# Altium schematic sheet schematic.SchDoc
size 368 x 266 mm
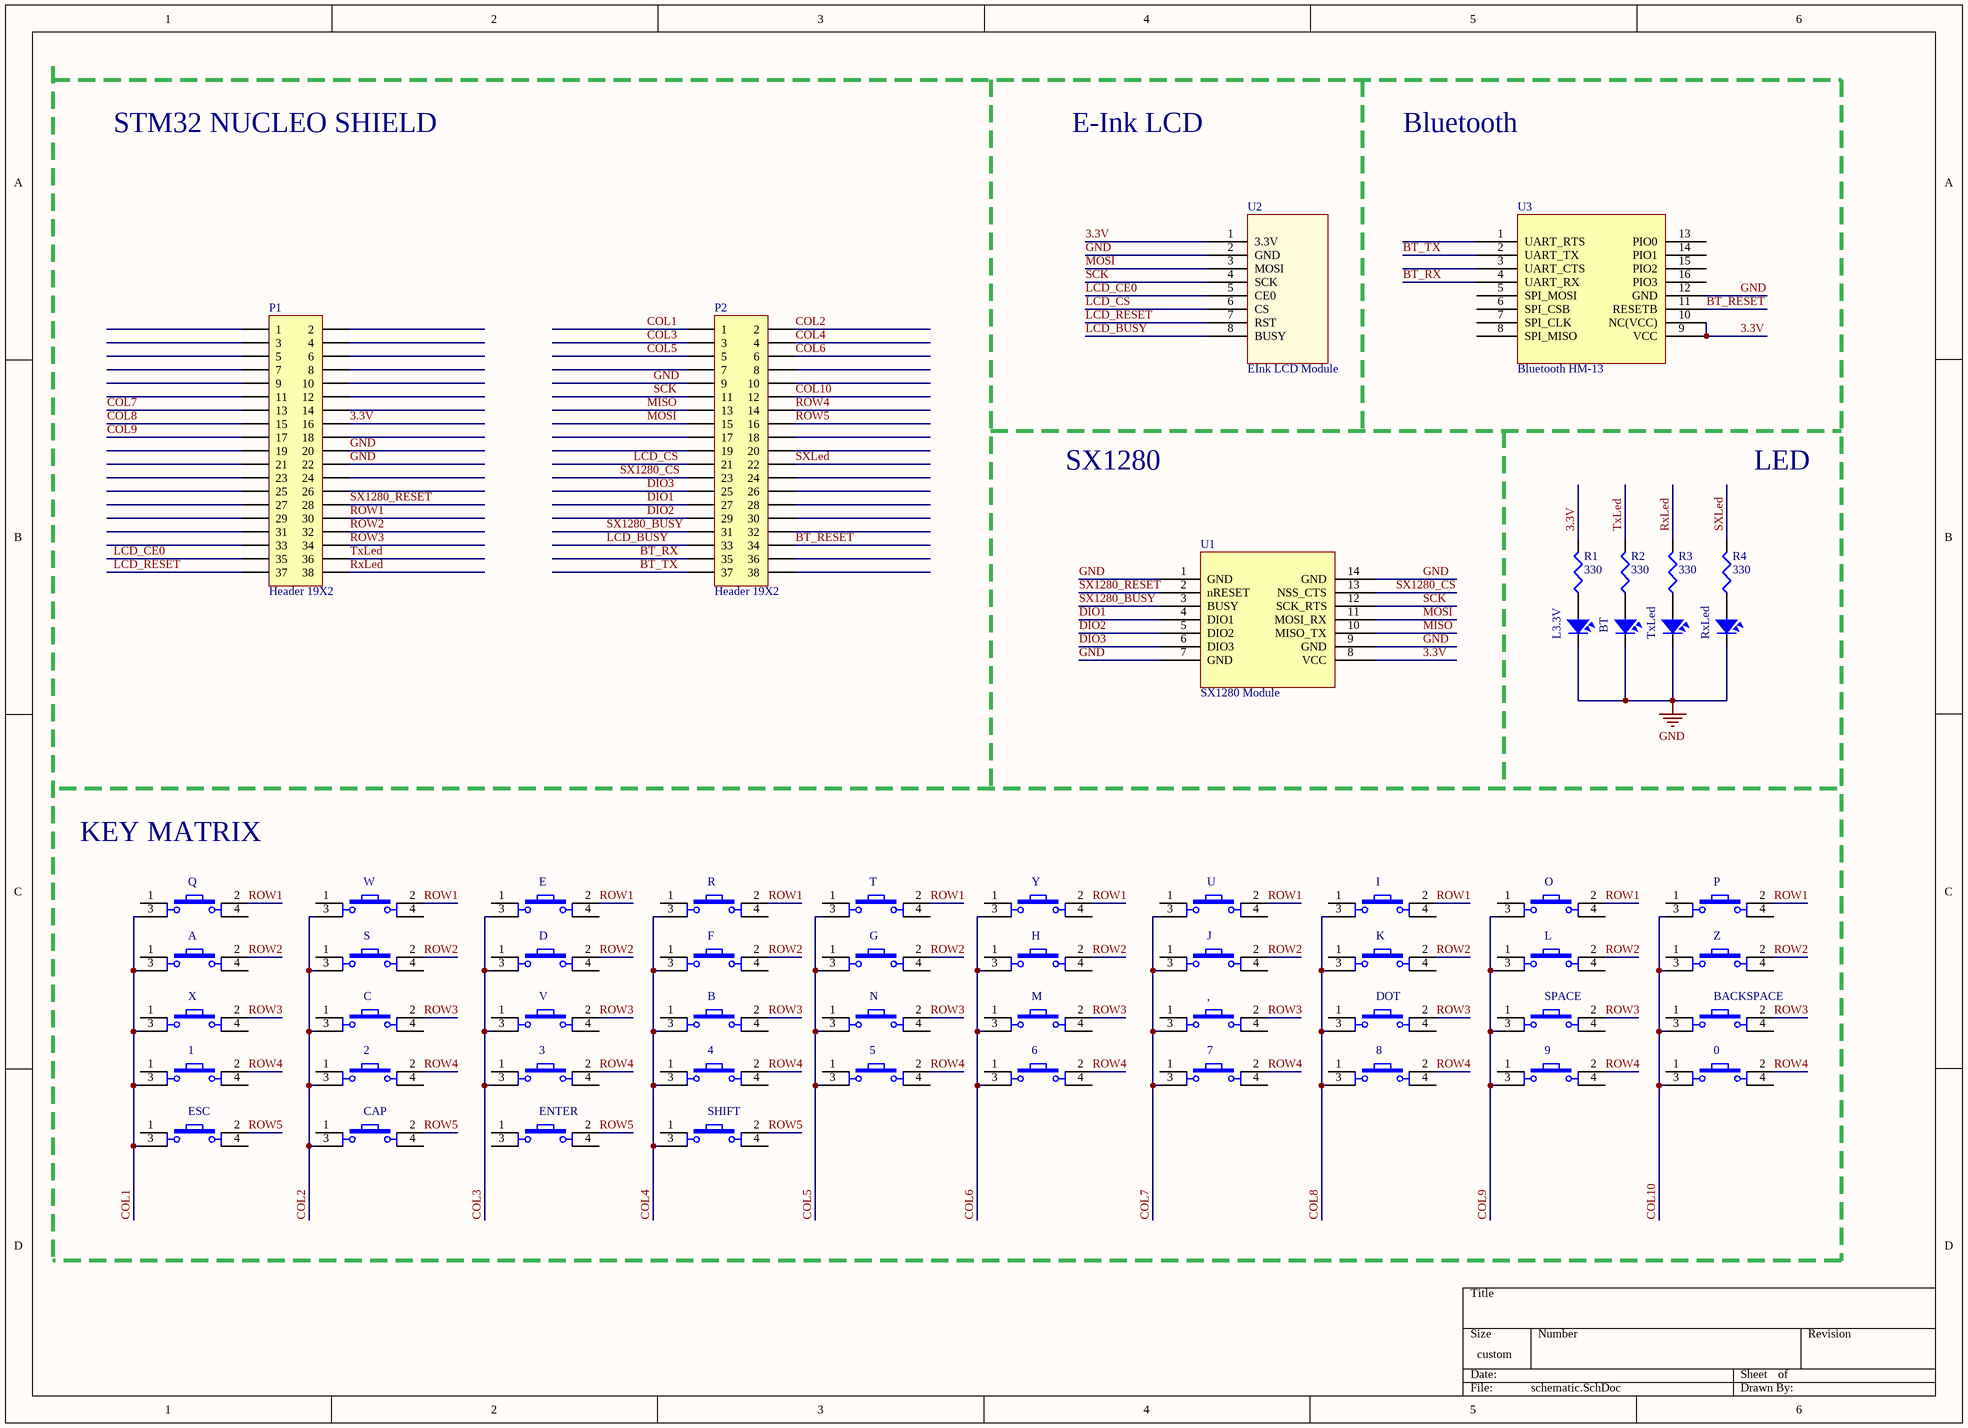
[diagram p0: schematic.SchDoc]

## Parts
0  SW  [Button 4 pins]  (value not drawn)
1  SW  [Button 4 pins]  (value not drawn)
2  SW  [Button 4 pins]  (value not drawn)
3  SW  [Button 4 pins]  (value not drawn)
4  SW  [Button 4 pins]  (value not drawn)
5  SW  [Button 4 pins]  (value not drawn)
6  SW  [Button 4 pins]  (value not drawn)
7  SW  [Button 4 pins]  (value not drawn)
8  SW  [Button 4 pins]  (value not drawn)
9  SW  [Button 4 pins]  (value not drawn)
,  SW  [Button 4 pins]  (value not drawn)
A  SW  [Button 4 pins]  (value not drawn)
B  SW  [Button 4 pins]  (value not drawn)
BACKSPACE  SW  [Button 4 pins]  (value not drawn)
BT  LED SMD  [SM-LED-0805-Blue]  (value not drawn)
C  SW  [Button 4 pins]  (value not drawn)
CAP  SW  [Button 4 pins]  (value not drawn)
D  SW  [Button 4 pins]  (value not drawn)
DOT  SW  [Button 4 pins]  (value not drawn)
E  SW  [Button 4 pins]  (value not drawn)
ENTER  SW  [Button 4 pins]  (value not drawn)
ESC  SW  [Button 4 pins]  (value not drawn)
F  SW  [Button 4 pins]  (value not drawn)
G  SW  [Button 4 pins]  (value not drawn)
H  SW  [Button 4 pins]  (value not drawn)
I  SW  [Button 4 pins]  (value not drawn)
J  SW  [Button 4 pins]  (value not drawn)
K  SW  [Button 4 pins]  (value not drawn)
L  SW  [Button 4 pins]  (value not drawn)
L3.3V  LED SMD  [SM-LED-0805-Blue]  (value not drawn)
M  SW  [Button 4 pins]  (value not drawn)
N  SW  [Button 4 pins]  (value not drawn)
O  SW  [Button 4 pins]  (value not drawn)
P  SW  [Button 4 pins]  (value not drawn)
P1  Header 19X2  [HDR2X19]
P2  Header 19X2  [HDR2X19]
Q  SW  [Button 4 pins]  (value not drawn)
R  SW  [Button 4 pins]  (value not drawn)
R1  value 330  [J1-0603]  (hidden comment: Res3)
R2  value 330  [J1-0603]  (hidden comment: Res3)
R3  value 330  [J1-0603]  (hidden comment: Res3)
R4  value 330  [J1-0603]  (hidden comment: Res3)
RxLed  LED SMD  [SM-LED-0805-Blue]  (value not drawn)
S  SW  [Button 4 pins]  (value not drawn)
SHIFT  SW  [Button 4 pins]  (value not drawn)
SPACE  SW  [Button 4 pins]  (value not drawn)
T  SW  [Button 4 pins]  (value not drawn)
TxLed  LED SMD  [SM-LED-0805-Blue]  (value not drawn)
U  SW  [Button 4 pins]  (value not drawn)
U1  SX1280 Module  [SX1280 Module]
U2  EInk LCD Module  [EInk_Module]
U3  Bluetooth HM-13  [Bluetooth HM-13]
V  SW  [Button 4 pins]  (value not drawn)
W  SW  [Button 4 pins]  (value not drawn)
X  SW  [Button 4 pins]  (value not drawn)
Y  SW  [Button 4 pins]  (value not drawn)
Z  SW  [Button 4 pins]  (value not drawn)

## Nets
GND: BT.2 L3.3V.2 P1.20 P1.22 P2.9 RxLed.2 TxLed.2 U1.1(GND) U1.7(GND) U1.9(GND) U1.14(GND) U2.2(GND) U3.12(GND)
3.3V: P1.16 R1.2 U1.8(VCC) U2.1(3.3V) U3.9(VCC) U3.10(NC(VCC))
BT_RESET: P2.34 U3.11(RESETB)
BT_RX: P2.35 U3.4(UART_RX)
BT_TX: P2.37 U3.2(UART_TX)
COL1: 1.3 A.3 ESC.3 P2.1 Q.3 X.3
COL2: 2.3 C.3 CAP.3 P2.2 S.3 W.3
COL3: 3.3 D.3 E.3 P2.3 V.3
COL4: 4.3 B.3 F.3 P2.4 R.3 SHIFT.3
COL5: 5.3 G.3 N.3 P2.5 T.3
COL6: 6.3 H.3 M.3 P2.6 Y.3
COL7: 7.3 ,.3 J.3 P1.13 U.3
COL8: 8.3 DOT.3 I.3 K.3 P1.15
COL9: 9.3 L.3 O.3 P1.17 SPACE.3
COL10: 0.3 BACKSPACE.3 P.3 P2.12 Z.3
DIO1: P2.27 U1.4(DIO1)
DIO2: P2.29 U1.5(DIO2)
DIO3: P2.25 U1.6(DIO3)
LCD_BUSY: P2.33 U2.8(BUSY)
LCD_CE0: P1.35 U2.5(CE0)
LCD_CS: P2.21 U2.6(CS)
LCD_RESET: P1.37 U2.7(RST)
MISO: P2.13 U1.10(MISO_TX)
MOSI: P2.15 U1.11(MOSI_RX) U2.3(MOSI)
ROW1: E.2 I.2 O.2 P.2 P1.30 Q.2 R.2 T.2 U.2 W.2 Y.2
ROW2: A.2 D.2 F.2 G.2 H.2 J.2 K.2 L.2 P1.32 S.2 Z.2
ROW3: ,.2 B.2 BACKSPACE.2 C.2 DOT.2 M.2 N.2 P1.34 SPACE.2 V.2 X.2
ROW4: 0.2 1.2 2.2 3.2 4.2 5.2 6.2 7.2 8.2 9.2 P2.14
ROW5: CAP.2 ENTER.2 ESC.2 P2.16 SHIFT.2
RxLed: P1.38 R3.2
SCK: P2.11 U1.12(SCK_RTS) U2.4(SCK)
SX1280_BUSY: P2.31 U1.3(BUSY)
SX1280_CS: P2.23 U1.13(NSS_CTS)
SX1280_RESET: P1.28 U1.2(nRESET)
SXLed: P2.22 R4.2
TxLed: P1.36 R2.2
NetBT_1: BT.1 R2.1
NetL3.3V_1: L3.3V.1 R1.1
NetR3_1: R3.1 TxLed.1
NetR4_1: R4.1 RxLed.1

Not connected (* = marked no-connect by the designer): 0 1 4; 1 1 4; 2 1 4; 3 1 4; 4 1 4; 5 1 4; 6 1 4; 7 1 4; 8 1 4; 9 1 4; , 1 4; A 1 4; B 1 4; BACKSPACE 1 4; C 1 4; CAP 1 4; D 1 4; DOT 1 4; E 1 4; ENTER 1 3 4; ESC 1 4; F 1 4; G 1 4; H 1 4; I 1 4; J 1 4; K 1 4; L 1 4; M 1 4; N 1 4; O 1 4; P 1 4; P1 1 2 3 4 5 6 7 8 9 10 11 12 14 18 19 21 23 24 25 26 27 29 31 33; P2 7 8 10 17 18 19 20 24 26 28 30 32 36 38; Q 1 4; R 1 4; S 1 4; SHIFT 1 4; SPACE 1 4; T 1 4; U 1 4; U3 1(UART_RTS) 3(UART_CTS) 5(SPI_MOSI) 6(SPI_CSB) 7(SPI_CLK) 8(SPI_MISO) 13(PIO0) 14(PIO1) 15(PIO2) 16(PIO3); V 1 4; W 1 4; X 1 4; Y 1 4; Z 1 4

## Notes on the sheet
- STM32 NUCLEO SHIELD
- E-Ink LCD
- Bluetooth
- SX1280
- LED
- KEY MATRIX

## Library data of the parts
0-9 , A B BACKSPACE C CAP D DOT E ENTER ESC F G H I J K L M N O P Q R S SHIFT SPACE T U V W X Y Z = SW4: Switch button 4 pin; Value: Button chip 4 pin
BT L3.3V RxLed TxLed = LED-SMD-0805
P1 P2 = Header 19X2: Header, 19-Pin, Dual row; LatestRevisionDate: 17-Jul-2002; LatestRevisionNote: Re-released for DXP Platform.; Publisher: Altium Limited
R1-R4 = Res3: Resistor; Published: 8-Jun-2000; LatestRevisionDate: 29-May-2009; LatestRevisionNote: IPC-7351 Footprint Added.; PackageReference: J1-0603; Publisher: Altium Limited; PackageDescription: Chip Resistor
U2 = E-Ink LCD